# EAGLE schematic ArduRCT_Remote-v2 (EAGLE 5.07)
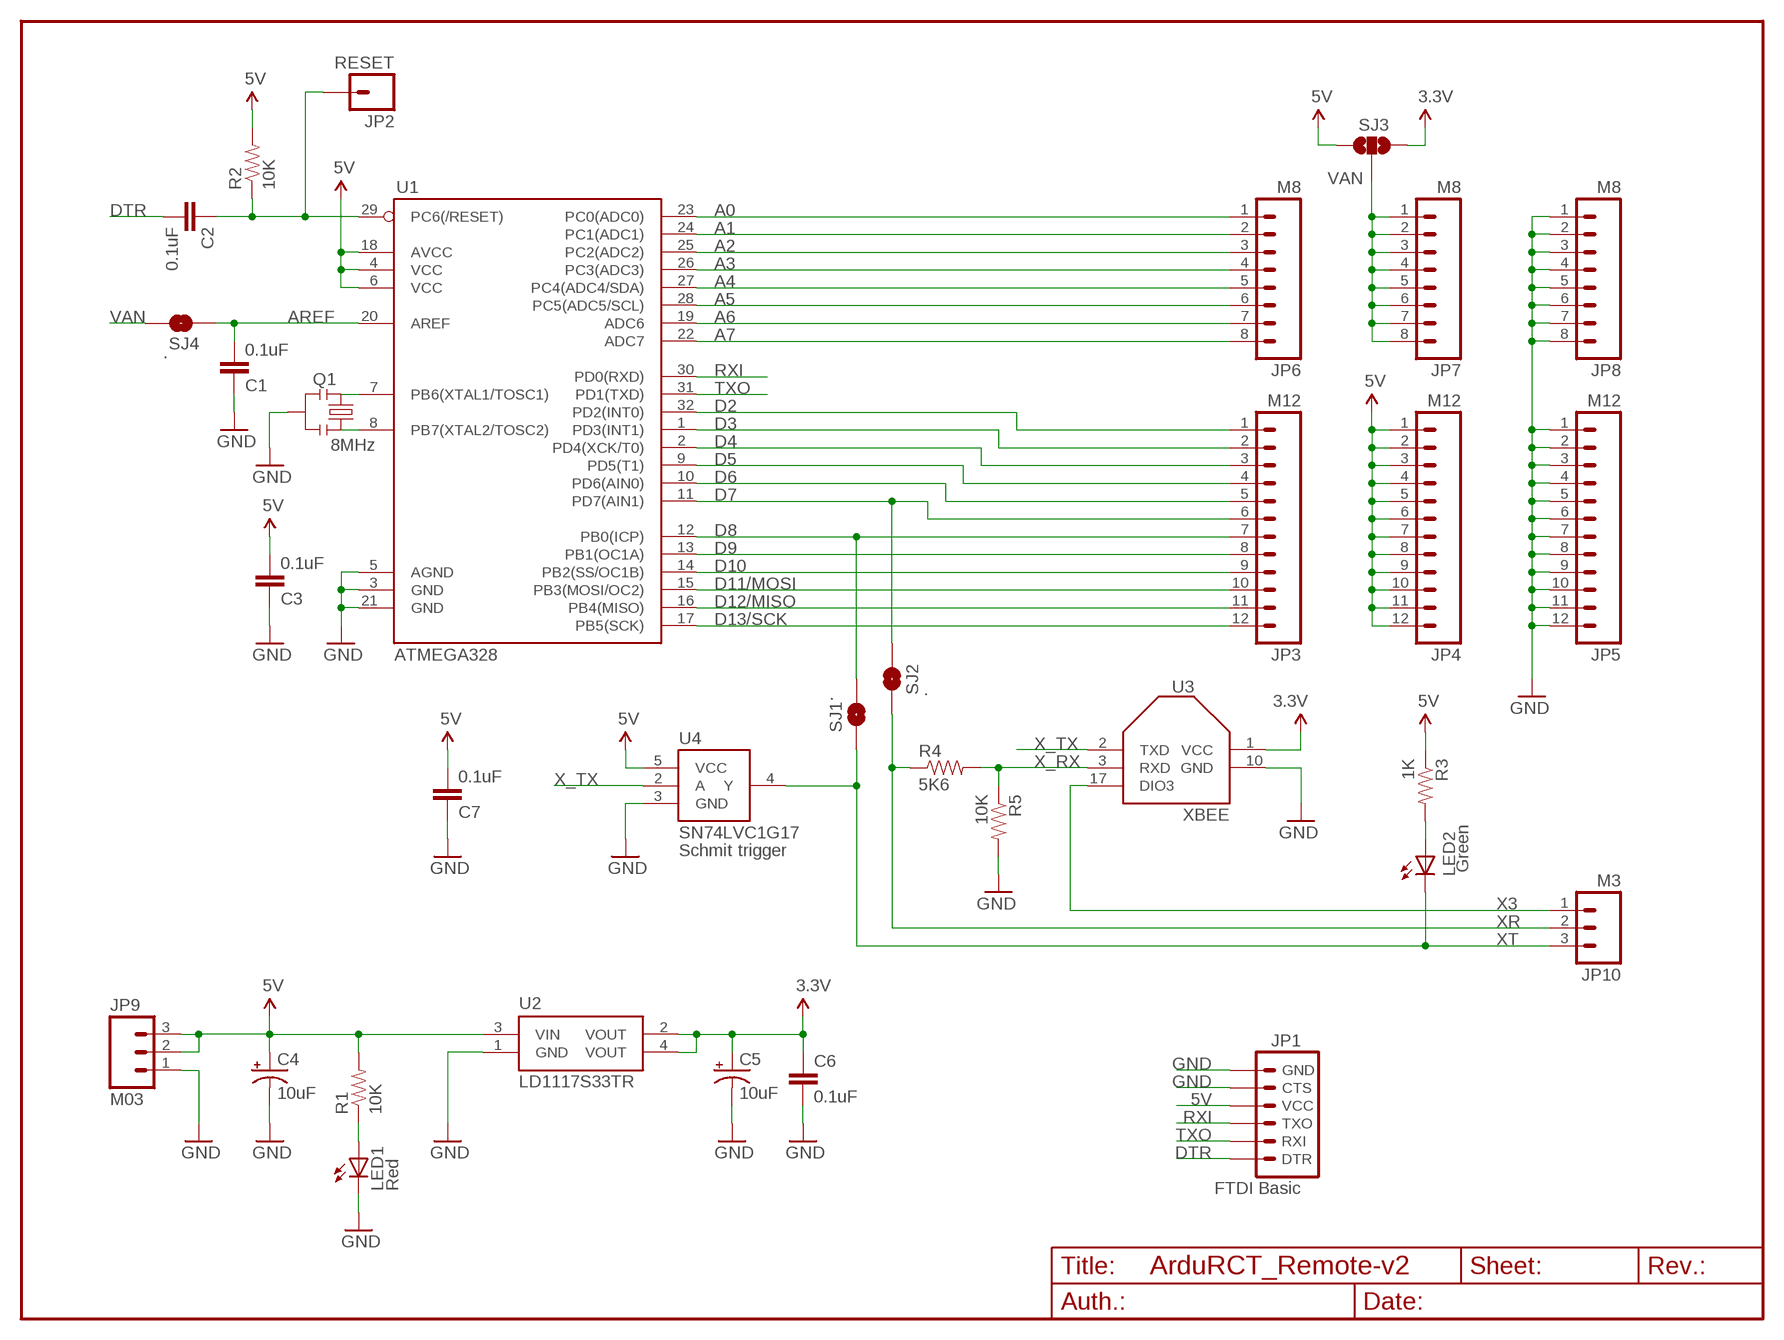
[diagram p0: schematic, sheet 1]

## Parts
C1  0.1uF  CAP0805  [0805]
C2  0.1uF  CAP0805  [0805]
C3  0.1uF  CAP0805  [0805]
C4  10uF  CAP_POL1206  [EIA3216]
C5  10uF  CAP_POL1206  [EIA3216]
C6  0.1uF  CAP0805  [0805]
C7  0.1uF  CAP0805  [0805]
JP1  FTDI Basic  ARDUINO_SERIAL_PROGRAMPTH  [1X06]
JP2  RESET  M01PTH  [1X01]
JP3  M12  M12PTH  [1X12]
JP4  M12  M12PTH  [1X12]
JP5  M12  M12PTH  [1X12]
JP6  M8  M081X08  [1X08]
JP7  M8  M081X08  [1X08]
JP8  M8  M081X08  [1X08]
JP9  M03  [1X3_LONGPAD]
JP10  M3  M03PTH  [1X03]
LED1  Red  LED805  [LED-0805]
LED2  Green  LED805  [LED-0805]
Q1  8MHz  RESONATORSMD  [RESONATOR-SMD]
R1  10K  RESISTOR0805-RES  [0805]
R2  10K  RESISTOR0805-RES  [0805]
R3  1K  RESISTOR0805-RES  [0805]
R4  5K6  RESISTOR0805-RES  [0805]
R5  10K  RESISTOR0805-RES  [0805]
SJ1  .  SOLDERJUMPERTRACE  [SJ_2S-TRACE]
SJ2  .  SOLDERJUMPERTRACE  [SJ_2S-TRACE]
SJ3  SJ_2WAYS_WIDE  [SJ_2WAYS_W]
SJ4  .  SOLDERJUMPERTRACE  [SJ_2S-TRACE]
U1  ATMEGA328  ATMEGA168  [TQFP32-08]
U2  LD1117S33TR  [SOT223]
U3  XBEE  XBEE-SIMPLE  [XBEE-SMD]
U4  SN74LVC1G17  [SOT23-5]

## Nets
3.3V: C5.A(+) C6.1 SJ3.3 U2.2(VOUT) U2.4(VOUT) U3.1(VCC)
5V: C3.2 C4.A(+) C7.2 JP1.4(VCC) JP4.1 JP4.2 JP4.3 JP4.4 JP4.5 JP4.6 JP4.7 JP4.8 JP4.9 JP4.10 JP4.11 JP4.12 JP9.2 JP9.3 R1.2 R2.2 R3.1 SJ3.1 U1.4(VCC) U1.6(VCC) U1.18(AVCC) U2.3(VIN) U4.5(VCC)
A0: JP6.1 U1.23(PC0(ADC0))
A1: JP6.2 U1.24(PC1(ADC1))
A2: JP6.3 U1.25(PC2(ADC2))
A3: JP6.4 U1.26(PC3(ADC3))
A4: JP6.5 U1.27(PC4(ADC4/SDA))
A5: JP6.6 U1.28(PC5(ADC5/SCL))
A6: JP6.7 U1.19(ADC6)
A7: JP6.8 U1.22(ADC7)
AREF: C1.2 SJ4.2 U1.20(AREF)
D2: JP3.1 U1.32(PD2(INT0))
D3: JP3.2 U1.1(PD3(INT1))
D4: JP3.3 U1.2(PD4(XCK/T0))
D5: JP3.4 U1.9(PD5(T1))
D6: JP3.5 U1.10(PD6(AIN0))
D7: JP3.6 SJ2.2 U1.11(PD7(AIN1))
D8: JP3.7 SJ1.1 U1.12(PB0(ICP))
D9: JP3.8 U1.13(PB1(OC1A))
D10: JP3.9 U1.14(PB2(SS/OC1B))
D11/MOSI: JP3.10 U1.15(PB3(MOSI/OC2))
D12/MISO: JP3.11 U1.16(PB4(MISO))
D13/SCK: JP3.12 U1.17(PB5(SCK))
DTR: C2.2 JP1.1(DTR)
GND [vcc]: C1.1 C3.1 C4.C(-) C5.C(-) C6.2 C7.1 JP1.5(CTS) JP1.6(GND) JP5.1 JP5.2 JP5.3 JP5.4 JP5.5 JP5.6 JP5.7 JP5.8 JP5.9 JP5.10 JP5.11 JP5.12 JP8.1 JP8.2 JP8.3 JP8.4 JP8.5 JP8.6 JP8.7 JP8.8 JP9.1 LED1.2(C) Q1.2 R5.2 U1.3(GND) U1.5(AGND) U1.21(GND) U2.1(GND) U3.10(GND) U4.3(GND)
N$1: Q1.1 U1.8(PB7(XTAL2/TOSC2))
N$2: Q1.3 U1.7(PB6(XTAL1/TOSC1))
N$7: LED2.1(A) R3.2
N$38: LED1.1(A) R1.1
RESET: C2.1 JP2.1 R2.1 U1.29(PC6(/RESET))
RXI: JP1.3(TXO) U1.30(PD0(RXD))
TXO: JP1.2(RXI) U1.31(PD1(TXD))
VAN: JP7.1 JP7.2 JP7.3 JP7.4 JP7.5 JP7.6 JP7.7 JP7.8 SJ3.2 SJ4.1
X3: JP10.1 U3.17(DIO3)
X_RX: R4.2 R5.1 U3.3(RXD)
X_TX: U3.2(TXD) U4.2(A)
XR: JP10.2 R4.1 SJ2.1
XT: JP10.3 LED2.2(C) SJ1.2 U4.4(Y)

## Notes on the sheet
- Schmit trigger

## Library data of the parts
C1-C3 C6 C7 = SparkFun:CAP: Capacitor Standard 0603 ceramic capacitor, and 0.1" leaded capacitor.
C4 C5 = SparkFun:CAP_POL: Capacitor Polarized These are standard SMD and PTH capacitors. Normally 10uF, 47uF, and 100uF in electrolytic and tantalum varieties. Always verify the external diameter of the through hole cap, it varies with capacity, voltage, and manufacturer. The EIA devices should be standard.
JP1 = SparkFun:ARDUINO_SERIAL_PROGRAM
JP2 = SparkFun:M01: Header 1 Standard 1-pin 0.1" header. Use with straight break away headers (SKU : PRT-00116), right angle break away headers (PRT-00553), swiss pins (PRT-00743), machine pins (PRT-00117), and female headers (PRT-00115).
JP3-JP5 = SparkFun:M12: Header 12 Standard 12-pin 0.1" header. Use with straight break away headers (SKU : PRT-00116), right angle break away headers (PRT-00553), swiss pins (PRT-00743), machine pins (PRT-00117), and female headers (PRT-00115).
JP6-JP8 = SparkFun:M08: Header 8 Standard 8-pin 0.1" header. Use with straight break away headers (SKU : PRT-00116), right angle break away headers (PRT-00553), swiss pins (PRT-00743), machine pins (PRT-00117), and female headers (PRT-00115).
JP9 = wibauxl:M03
JP10 = SparkFun:M03: Header 3 Standard 3-pin 0.1" header. Use with straight break away headers (SKU : PRT-00116), right angle break away headers (PRT-00553), swiss pins (PRT-00743), machine pins (PRT-00117), and female headers (PRT-00115). Molex polarized connector foot print use with SKU : PRT-08232 with associated crimp pins and housings.
LED1 LED2 = wibauxl:LED
Q1 = SparkFun:RESONATOR: Resonator Small SMD resonator. This is the itty bitty 10/20MHz resonators with built in caps. CSTCE10M0G55 and CSTCE20M0V53. Footprint has been reviewed closely but hasn't been tested yet.
R1-R5 = SparkFun:RESISTOR: Resistor Basic schematic elements and footprints for 0603, 1206, and PTH resistors.
SJ1 SJ2 SJ4 = SparkFun:SOLDERJUMPER: Solder Jumper Standard SMD solder jumper. Used to automate production. Two varients : Normally Open and Normally Closed are the same, but have different paste layers. NC will have a large amount of paste and should jumper during reflow.
SJ3 = wibauxl:SJ_2WAYS
U1 = SparkFun:ATMEGA168
U2 = wibauxl:LD1117S33TR
U3 = wibauxl:XBEE-SIMPLE
U4 = wibauxl:SN74LVC1G17

## Net classes
0 default: width 0.203 mm
1 vcc: width 0.254 mm